# Altium project GaugeMaster.PrjPcb
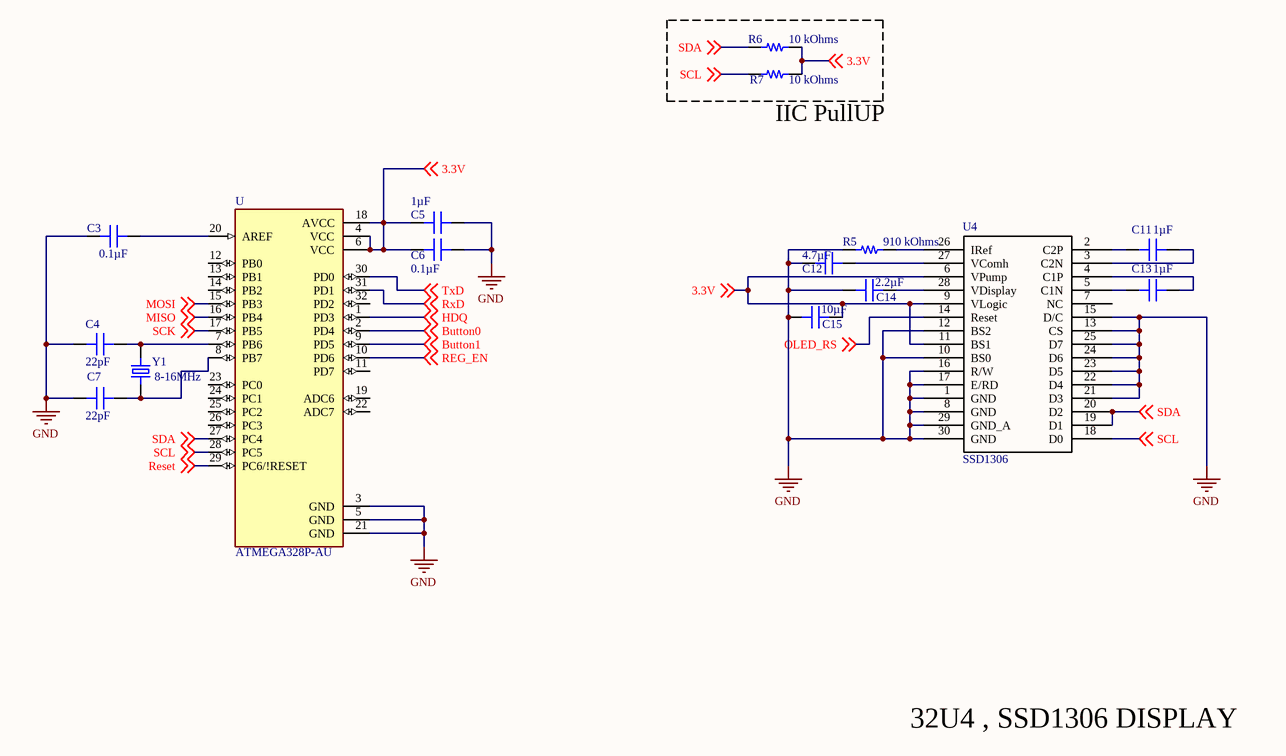
[diagram p0: Sheet2.SchDoc]
2 sheets, 33 parts. Net scope: global (net labels, ports and power ports of the same name join across sheets).
Board file: PCB1.PcbDoc
Sheets:
  Sheet2.SchDoc
  Sheet1.SchDoc

## Sheet Sheet2.SchDoc
size A4

### Parts
C3  0.1µF  [CAP 0402_1005]
C4  22pF  [CAP 0402_1005]
C5  1µF  [CAP 0402_1005]
C6  0.1µF  [CAP 0402_1005]
C7  22pF  [CAP 0402_1005]
C11  1µF  [CAP 0402_1005]
C12  4.7µF  [CAP 0402_1005]
C13  1µF  [CAP 0402_1005]
C14  2.2µF  [CAP 0402_1005]
C15  10µF  [CAP 0402_1005]
R5  910 kOhms  [RES 0402_1005]
R6  10 kOhms  [RES 0402_1005]
R7  10 kOhms  [RES 0402_1005]
U  ATMEGA328P-AU  [QFP80P900X900X120-32N]
U4  SSD1306  [PCBComponent_1]
Y1  8-16MHz  [XTAL_ECS-80-18-4XDN]

### Nets
GND: C3.2 C4.2 C5.1 C6.2 C7.2 C12.1 C14.1 C15.1 R5.2 U.3(GND) U.5(GND) U.21(GND) U4.1(GND) U4.8(GND) U4.10(BS0) U4.12(BS2) U4.13(CS) U4.15(D/C) U4.16(R/W) U4.17(E/RD) U4.21(D3) U4.22(D4) U4.23(D5) U4.24(D6) U4.25(D7) U4.29(GND_A) U4.30(GND)
3.3V: C5.2 C6.1 C15.2 R6.1 R7.1 U.4(VCC) U.6(VCC) U.18(AVCC) U4.6(VPump) U4.9(VLogic) U4.11(BS1) ; off-sheet 3.3V
Button0: U.2(PD4) ; off-sheet Button0
Button1: U.9(PD5) ; off-sheet Button1
HDQ: U.1(PD3) ; off-sheet HDQ
MISO: U.16(PB4) ; off-sheet MISO
MOSI: U.15(PB3) ; off-sheet MOSI
OLED_RS: U.29(PC6/!RESET) U4.14(Reset) ; off-sheet Reset, off-sheet OLED_RS  [also labelled Reset]
REG_EN: U.10(PD6) ; off-sheet REG_EN
RxD: U.31(PD1) ; off-sheet RxD
SCK: U.17(PB5) ; off-sheet SCK
SCL: R7.2 U.28(PC5) U4.18(D0) ; off-sheet SCL
SDA: R6.2 U.27(PC4) U4.19(D1) U4.20(D2) ; off-sheet SDA
TxD: U.30(PD0) ; off-sheet TxD
NetC3_1: C3.1 U.20(AREF)
NetC4_1: C4.1 U.7(PB6) Y1.2
NetC7_1: C7.1 U.8(PB7) Y1.1
NetC11_1: C11.1 U4.2(C2P)
NetC11_2: C11.2 U4.3(C2N)
NetC12_2: C12.2 U4.27(VComh)
NetC13_1: C13.1 U4.5(C1N)
NetC13_2: C13.2 U4.4(C1P)
NetC14_2: C14.2 U4.28(VDisplay)
NetR5_1: R5.1 U4.26(IRef)

Not connected (* = marked no-connect by the designer): U 11(PD7) 12(PB0) 13(PB1) 14(PB2) 19(ADC6) 22(ADC7) 23(PC0) 24(PC1) 25(PC2) 26(PC3) 32(PD2); U4 7(NC)

### Notes on the sheet
- (near R7) IIC PullUP
- 32U4 , SSD1306 DISPLAY

### Library data of the parts
C3-C7 C11-C14 = CL05A106MP8NUB8: CAP CER 10UF 10V X5R 0402; Manufacturer: Samsung Electro-Mechanics; Capacitance: 10µF; Tolerance: ±20%; Part Number: CL05A106MP8NUB8; Applications: General Purpose; ComponentLink1Description: Datasheet; ComponentLink1URL: http://www.samsungsem.com/kr/support/product-search/mlcc/CL05A106MP8NUB8.jsp; ComponentLink2Description: DigiKey Link; ComponentLink2URL: http://digikey.com/product-detail/en/samsung-electro-mechanics/CL05A106MP8NUB8/1276-6830-1-ND/5961689; Device Package: 0402 (1005 Metric); LastUpdated: 19.01.2020 16:07:13; Lifecycle Status: Active; Minimum Order: 1; Mounting Type: Surface Mount, MLCC; Operating Temperature: -55°C ~ 85°C; Package / Case: 0402 (1005 Metric); Packaging: TapeAndReel; PartId: 1758; Part Status: Active; Price: 0.08; Series: CL; Size / Dimension: 0.039" L x 0.020" W (1.00mm x 0.50mm); Supplier 1: DigiKey; Supplier Part Number 1: 1276-6830-1-ND; Temperature Coefficient: X5R; Thickness (Max): 0.035" (0.90mm); Voltage - Rated: 10V
  C3 C6: Value: 0.1µF
  C4 C7: Value: 22pF
  C5 C11 C13: Value: 1µF
  C12: Value: 4.7µF
  C14: Value: 2.2µF
C15 = CL05A106MP8NUB8: CAP CER 10UF 10V X5R 0402; Manufacturer: Samsung Electro-Mechanics; Tolerance: ±20%; Part Number: CL05A106MP8NUB8; Value: 10µF; Applications: General Purpose; Capacitance: 10µF; ComponentLink1Description: Datasheet; ComponentLink1URL: http://www.samsungsem.com/kr/support/product-search/mlcc/CL05A106MP8NUB8.jsp; ComponentLink2Description: DigiKey Link; ComponentLink2URL: http://digikey.com/product-detail/en/samsung-electro-mechanics/CL05A106MP8NUB8/1276-6830-1-ND/5961689; Device Package: 0402 (1005 Metric); LastUpdated: 19.01.2020 16:07:13; Lifecycle Status: Active; Minimum Order: 1; Mounting Type: Surface Mount, MLCC; Operating Temperature: -55°C ~ 85°C; Package / Case: 0402 (1005 Metric); Packaging: TapeAndReel; PartId: 1758; Part Status: Active; Price: 0.08; Series: CL; Size / Dimension: 0.039" L x 0.020" W (1.00mm x 0.50mm); Supplier 1: DigiKey; Supplier Part Number 1: 1276-6830-1-ND; Temperature Coefficient: X5R; Thickness (Max): 0.035" (0.90mm); Voltage - Rated: 10V
R5-R7 = RP73PF1E10KBTD: RES 10K OHM 0.1% 1/10W 0402; Manufacturer: TE Connectivity Passive Product; Power (Watts): 0.1W, 1/10W; Temperature Coefficient: ±25ppm/°C; Part Number: RP73PF1E10KBTD; ComponentLink1Description: Datasheet; ComponentLink1URL: https://www.te.com/commerce/DocumentDelivery/DDEController?Action=srchrtrv&DocNm=1773272&DocType=DS&DocLang=English; ComponentLink2Description: DigiKey Link; ComponentLink2URL: http://digikey.com/product-detail/en/te-connectivity-passive-product/RP73PF1E10KBTD/A127415CT-ND/8261381; Composition: Thin Film; Device Package: 0402 (1005 Metric); Height - Seated (Max): 0.014" (0.35mm); LastUpdated: 19.01.2020 16:11:48; Lifecycle Status: Active; Minimum Order: 1; Number of Terminations: 2; Operating Temperature: -55°C ~ 155°C; Package / Case: 0402 (1005 Metric); Packaging: TapeAndReel; PartId: 2434; Part Status: Active; Price: 0.08; Resistance: 10 kOhms; Series: RP73P, Holsworthy; Size / Dimension: 0.039" L x 0.020" W (1.00mm x 0.50mm); Supplier 1: DigiKey; Supplier Part Number 1: A127415CT-ND; Supplier Device Package: 0402; Tolerance: ±0.1%
  R5: Value: 910 kOhms
  R6 R7: Value: 10 kOhms
U = ATMEGA328P-AU: AVR AVRÂ® ATmega Microcontroller IC 8-Bit 20MHz 32KB _16K x 16_ FLASH 32-TQFP _7x7_; MF: Microchip Technology; MP: ATMEGA328P-AU; Availability: Unavailable; Package: TQFP-32 Microchip Technology; Value: *; Price: None; SnapEDA_Link: https://www.snapeda.com/parts/ATMEGA328P-AU/Microchip/view-part/4593405/?ref=snap
Y1 = ECS-80-18-4XDN: 8MHz Â±30ppm Crystal 18pF 80 Ohms HC-49/US; MF: ECS Inc.; Digi-Key_Part_Number: X1115-ND; Package: HC-49/US ECS International; Value: *; SnapEDA_Link: https://www.snapeda.com/parts/ECS-80-18-4XDN/ECS%20Inc./view-part/49558/?ref=snap; Digi-Key_Purchase_URL: https://www.digikey.in/product-detail/en/ecs-inc/ECS-80-18-4XDN/X1115-ND/827606?utm_source=snapeda&utm_medium=aggregator&utm_campaign=symbol; MP: ECS-80-18-4XDN

## Sheet Sheet1.SchDoc
size A4
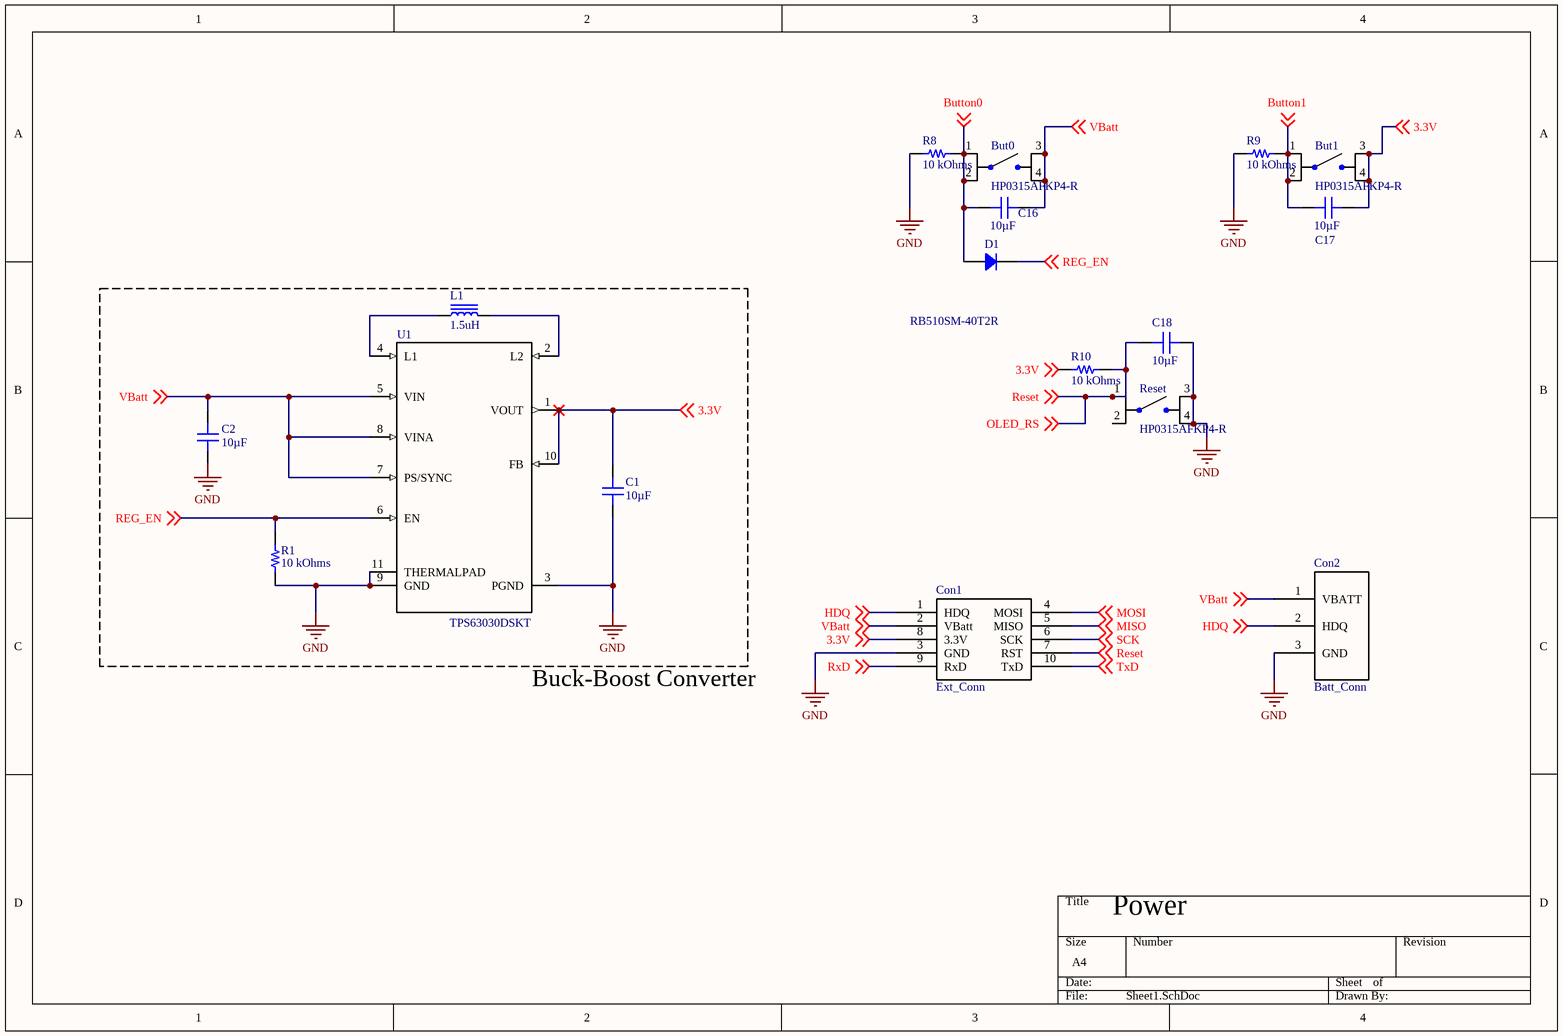
[diagram p1: Sheet1.SchDoc]

### Parts
But0  HP0315AFKP4-R  [*SW_HP0315AFKP4-R]
But1  HP0315AFKP4-R  [*SW_HP0315AFKP4-R]
C1  10µF  [CAP 0402_1005]
C2  10µF  [CAP 0402_1005]
C16  10µF  [CAP 0402_1005]
C17  10µF  [CAP 0402_1005]
C18  10µF  [CAP 0402_1005]
Con1  Ext_Conn  [JtagConn]
Con2  Batt_Conn  [BattConn]
D1  RB510SM-40T2R  [SOD-523]
L1  1.5uH  [TDK VLCF4028-2]
R1  10 kOhms  [RES 0402_1005]
R8  10 kOhms  [RES 0402_1005]
R9  10 kOhms  [RES 0402_1005]
R10  10 kOhms  [RES 0402_1005]
Reset  HP0315AFKP4-R  [*SW_HP0315AFKP4-R]
U1  TPS63030DSKT  [*SON50P260X260X80-11N]

### Nets
GND: C1.1 C2.1 C18.1 Con1.3(GND) Con2.3(GND) R1.1 R8.1 R9.2 Reset.3 Reset.4 U1.3(PGND) U1.9(GND) U1.11(THERMALPAD)
3.3V: But1.3 But1.4 C1.2 C17.1 Con1.8(3.3V) R10.2 U1.1(VOUT) U1.10(FB) ; off-sheet 3.3V
Button0: But0.1 But0.2 C16.2 D1.1 R8.2 ; off-sheet Button0
Button1: But1.1 But1.2 C17.2 R9.1 ; off-sheet Button1
HDQ: Con1.1(HDQ) Con2.2(HDQ) ; off-sheet HDQ
MISO: Con1.5(MISO) ; off-sheet MISO
MOSI: Con1.4(MOSI) ; off-sheet MOSI
OLED_RS: C18.2 Con1.7(RST) R10.1 Reset.1 ; off-sheet Reset, off-sheet OLED_RS  [also labelled Reset]
REG_EN: D1.2 R1.2 U1.6(EN) ; off-sheet REG_EN
RxD: Con1.9(RxD) ; off-sheet RxD
SCK: Con1.6(SCK) ; off-sheet SCK
TxD: Con1.10(TxD) ; off-sheet TxD
VBatt: But0.3 But0.4 C2.2 C16.1 Con1.2(VBatt) Con2.1(VBATT) U1.5(VIN) U1.7(PS/SYNC) U1.8(VINA) ; off-sheet VBatt
NetL1_1: L1.1 U1.4(L1)
NetL1_2: L1.2 U1.2(L2)

Not connected (* = marked no-connect by the designer): Reset 2

### Notes on the sheet
- Buck-Boost Converter
- Power

### Library data of the parts
But0 But1 Reset = HP0315AFKP4-R: Tactile Switch SPST-NO Top Actuated Surface Mount; MF: NKK Switches; MP: HP0315AFKP4-R; Availability: Unavailable; Package: None; SnapEDA_Link: https://www.snapeda.com/parts/HP0315AFKP4-R/NKK%20Switches/view-part/379626/?ref=snap; Price: None; Value: *
C1 C2 C16-C18 = CL05A106MP8NUB8: as C15 on sheet Sheet2; Part Number: CL05A106MP8NUB8; Value: 10µF; Applications: General Purpose; Capacitance: 10µF; ComponentLink1Description: Datasheet; ComponentLink1URL: http://www.samsungsem.com/kr/support/product-search/mlcc/CL05A106MP8NUB8.jsp; ComponentLink2Description: DigiKey Link; ComponentLink2URL: http://digikey.com/product-detail/en/samsung-electro-mechanics/CL05A106MP8NUB8/1276-6830-1-ND/5961689; Device Package: 0402 (1005 Metric); LastUpdated: 19.01.2020 16:07:13; Lifecycle Status: Active; Minimum Order: 1; Mounting Type: Surface Mount, MLCC; Operating Temperature: -55°C ~ 85°C; Package / Case: 0402 (1005 Metric); Packaging: TapeAndReel; PartId: 1758; Part Status: Active; Price: 0.08; Series: CL; Size / Dimension: 0.039" L x 0.020" W (1.00mm x 0.50mm); Supplier 1: DigiKey; Supplier Part Number 1: 1276-6830-1-ND; Temperature Coefficient: X5R; Thickness (Max): 0.035" (0.90mm); Voltage - Rated: 10V
D1 = RB510SM-40T2R: RB510SM-40 IS LOW VF; Manufacturer: Rohm Semiconductor; Current - Average Rectified (Io): 100mA; Current - Reverse Leakage @ Vr: 2µA @ 40V; Diode Type: Schottky; Speed: Small Signal =< 200mA (Io), Any Speed; Voltage - DC Reverse (Vr) (Max): 40V; Voltage - Forward (Vf) (Max) @ If: 480mV @ 10mA; Part Number: RB510SM-40T2R; ComponentLink1Description: Datasheet; ComponentLink1URL: https://www.rohm.com/datasheet/RB510SM-40/rb510sm-40t2r-e; ComponentLink2Description: DigiKey Link; ComponentLink2URL: http://digikey.com/product-detail/en/rohm-semiconductor/RB510SM-40T2R/846-RB510SM-40T2RCT-ND/10670875; Device Package: SC-79, SOD-523; LastUpdated: 19.01.2020 16:25:52; Lifecycle Status: Active; Minimum Order: 1; Mounting Type: Surface Mount; Operating Temperature - Junction: 150°C (Max); Package / Case: SC-79, SOD-523; Packaging: Unknown; PartId: 2868; Part Status: Active; Price: 0.03; Series: -; Supplier 1: DigiKey; Supplier Part Number 1: 846-RB510SM-40T2RCT-ND; Supplier Device Package: EMD2
L1 = VLCF5028T-560MR43-2: FIXED IND 56UH 430MA 410 MOHM; Manufacturer: TDK Corporation; DC Resistance (DCR): 410mOhm Max; Inductance: 56µH; Inductance Frequency - Test: 100kHz; Material - Core: Ferrite; Shielding: Shielded; Tolerance: ±20%; Type: Wirewound; Value: 56µH; Part Number: VLCF5028T-560MR43-2; ComponentLink1Description: Datasheet; ComponentLink1URL: https://product.tdk.com/info/en/catalog/datasheets/inductor_commercial_power_vlcf5028-2_en.pdf?ref_disty=digikey; ComponentLink2Description: DigiKey Link; ComponentLink2URL: http://digikey.com/product-detail/en/tdk-corporation/VLCF5028T-560MR43-2/445-6567-1-ND/2465874; Current Rating (Amps): 430mA; Current - Saturation: 430mA; Device Package: Nonstandard; Height - Seated (Max): 0.110" (2.80mm); LastUpdated: 19.01.2020 16:24:51; Lifecycle Status: Active; Minimum Order: 1; Mounting Type: Surface Mount; Operating Temperature: -40°C ~ 105°C; Package / Case: Nonstandard; Packaging: TapeAndReel; PartId: 193; Part Status: Active; Price: 0.63; Series: VLCF; Size / Dimension: 0.197" L x 0.197" W (5.00mm x 5.00mm); Supplier 1: DigiKey; Supplier Part Number 1: 445-6567-1-ND
R1 R8-R10 = RP73PF1E10KBTD: as R5 on sheet Sheet2; Part Number: RP73PF1E10KBTD; Value: 10 kOhms; ComponentLink1Description: Datasheet; ComponentLink1URL: https://www.te.com/commerce/DocumentDelivery/DDEController?Action=srchrtrv&DocNm=1773272&DocType=DS&DocLang=English; ComponentLink2Description: DigiKey Link; ComponentLink2URL: http://digikey.com/product-detail/en/te-connectivity-passive-product/RP73PF1E10KBTD/A127415CT-ND/8261381; Composition: Thin Film; Device Package: 0402 (1005 Metric); Height - Seated (Max): 0.014" (0.35mm); LastUpdated: 19.01.2020 16:11:48; Lifecycle Status: Active; Minimum Order: 1; Number of Terminations: 2; Operating Temperature: -55°C ~ 155°C; Package / Case: 0402 (1005 Metric); Packaging: TapeAndReel; PartId: 2434; Part Status: Active; Price: 0.08; Resistance: 10 kOhms; Series: RP73P, Holsworthy; Size / Dimension: 0.039" L x 0.020" W (1.00mm x 0.50mm); Supplier 1: DigiKey; Supplier Part Number 1: A127415CT-ND; Supplier Device Package: 0402; Tolerance: ±0.1%
U1 = TPS63030DSKT: Buck-Boost Switching Regulator IC Positive Adjustable 1.2V 1 Output 900mA _Switch_ 10-WFDFN Exposed Pad; MF: Texas Instruments; Package: SON-10 Texas Instruments; SnapEDA_Link: https://www.snapeda.com/parts/TPS63030DSKT/Texas%20Instruments/view-part/449700/?ref=snap; Price: None; MP: TPS63030DSKT; Availability: Unavailable; Value: *

## Nets that join several sheets
GND: Sheet2 (27 pins), Sheet1 (13 pins)
3.3V: Sheet2 (11 pins), Sheet1 (8 pins)
Button0: Sheet2 (U.2), Sheet1 (5 pins)
Button1: Sheet2 (U.9), Sheet1 (But1.1 But1.2 C17.2 R9.1)
HDQ: Sheet2 (U.1), Sheet1 (Con1.1 Con2.2)
MISO: Sheet2 (U.16), Sheet1 (Con1.5)
MOSI: Sheet2 (U.15), Sheet1 (Con1.4)
OLED_RS: Sheet2 (U.29 U4.14), Sheet1 (C18.2 Con1.7 R10.1 Reset.1)
REG_EN: Sheet2 (U.10), Sheet1 (D1.2 R1.2 U1.6)
RxD: Sheet2 (U.31), Sheet1 (Con1.9)
SCK: Sheet2 (U.17), Sheet1 (Con1.6)
TxD: Sheet2 (U.30), Sheet1 (Con1.10)